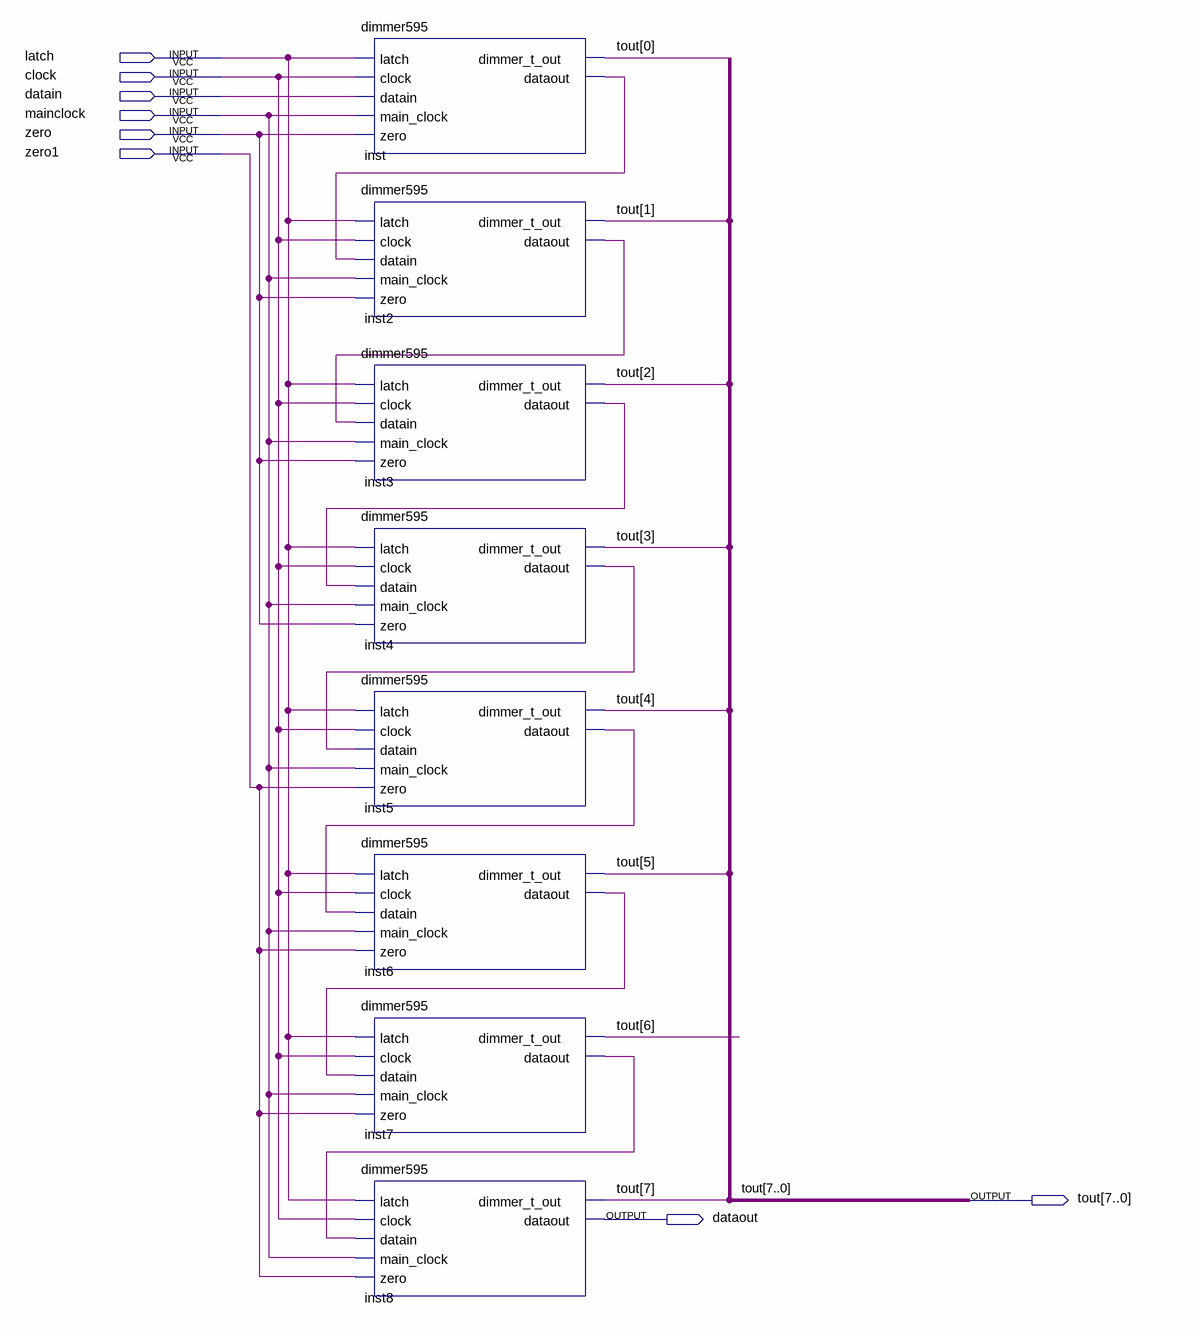
[diagram p0: schematic sheet]
// Quartus schematic 8dimmer595.bdf as structural Verilog: 8 symbols, 8 pins
module \8dimmer595  (
  input  latch,
  input  clock,
  input  datain,
  input  mainclock,
  input  zero,
  input  zero1,
  output [7:0] tout,
  output dataout
);

  wire inst2_dataout, inst3_dataout, inst4_dataout, inst5_dataout, inst6_dataout, inst7_dataout, inst_dataout;

  dimmer595 inst (
    .latch(latch), .clock(clock), .datain(datain), .main_clock(mainclock), .zero(zero),
    .dimmer_t_out(tout[0]), .dataout(inst_dataout));
  dimmer595 inst2 (
    .latch(latch), .clock(clock), .datain(inst_dataout), .main_clock(mainclock), .zero(zero),
    .dimmer_t_out(tout[1]), .dataout(inst2_dataout));
  dimmer595 inst3 (
    .latch(latch), .clock(clock), .datain(inst2_dataout), .main_clock(mainclock), .zero(zero),
    .dimmer_t_out(tout[2]), .dataout(inst3_dataout));
  dimmer595 inst4 (
    .latch(latch), .clock(clock), .datain(inst3_dataout), .main_clock(mainclock), .zero(zero),
    .dimmer_t_out(tout[3]), .dataout(inst4_dataout));
  dimmer595 inst5 (
    .latch(latch), .clock(clock), .datain(inst4_dataout), .main_clock(mainclock), .zero(zero1),
    .dimmer_t_out(tout[4]), .dataout(inst5_dataout));
  dimmer595 inst6 (
    .latch(latch), .clock(clock), .datain(inst5_dataout), .main_clock(mainclock), .zero(zero1),
    .dimmer_t_out(tout[5]), .dataout(inst6_dataout));
  dimmer595 inst7 (
    .latch(latch), .clock(clock), .datain(inst6_dataout), .main_clock(mainclock), .zero(zero1),
    .dimmer_t_out(tout[6]), .dataout(inst7_dataout));
  dimmer595 inst8 (
    .latch(latch), .clock(clock), .datain(inst7_dataout), .main_clock(mainclock), .zero(zero1),
    .dimmer_t_out(tout[7]), .dataout(dataout));
endmodule
